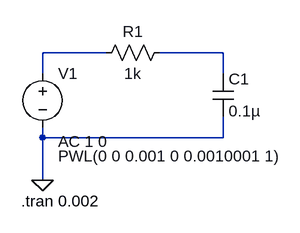
[diagram p0: schematic Draft1.asc]
Draft1.asc, the LTspice schematic file:
Version 4
SHEET 1 880 680
WIRE 224 144 128 144
WIRE 400 144 304 144
WIRE 128 176 128 144
WIRE 400 176 400 144
WIRE 128 272 128 256
WIRE 400 272 400 240
WIRE 400 272 128 272
WIRE 128 336 128 272
FLAG 128 336 0
SYMBOL res 320 128 R90
WINDOW 0 0 56 VBottom 2
WINDOW 3 32 56 VTop 2
SYMATTR InstName R1
SYMATTR Value 1k
SYMBOL cap 384 176 R0
SYMATTR InstName C1
SYMATTR Value 0.1µ
SYMBOL voltage 128 160 R0
WINDOW 3 24 140 Left 2
WINDOW 123 24 118 Left 2
SYMATTR InstName V1
SYMATTR Value PWL(0 0 0.001 0 0.0010001 1)
SYMATTR Value2 AC 1 0
TEXT 96 368 Left 2 !.tran 0.002

The netlist it stands for:
* Draft1.asc
R1 N002 N001 1k
C1 N002 0 0.1µ
V1 N001 0 PWL(0 0 0.001 0 0.0010001 1) AC 1 0
.tran 0.002
.backanno
.end